# EAGLE design K_line_ESP32 (EAGLE 9.5.1)

## Sheet 1 of 2
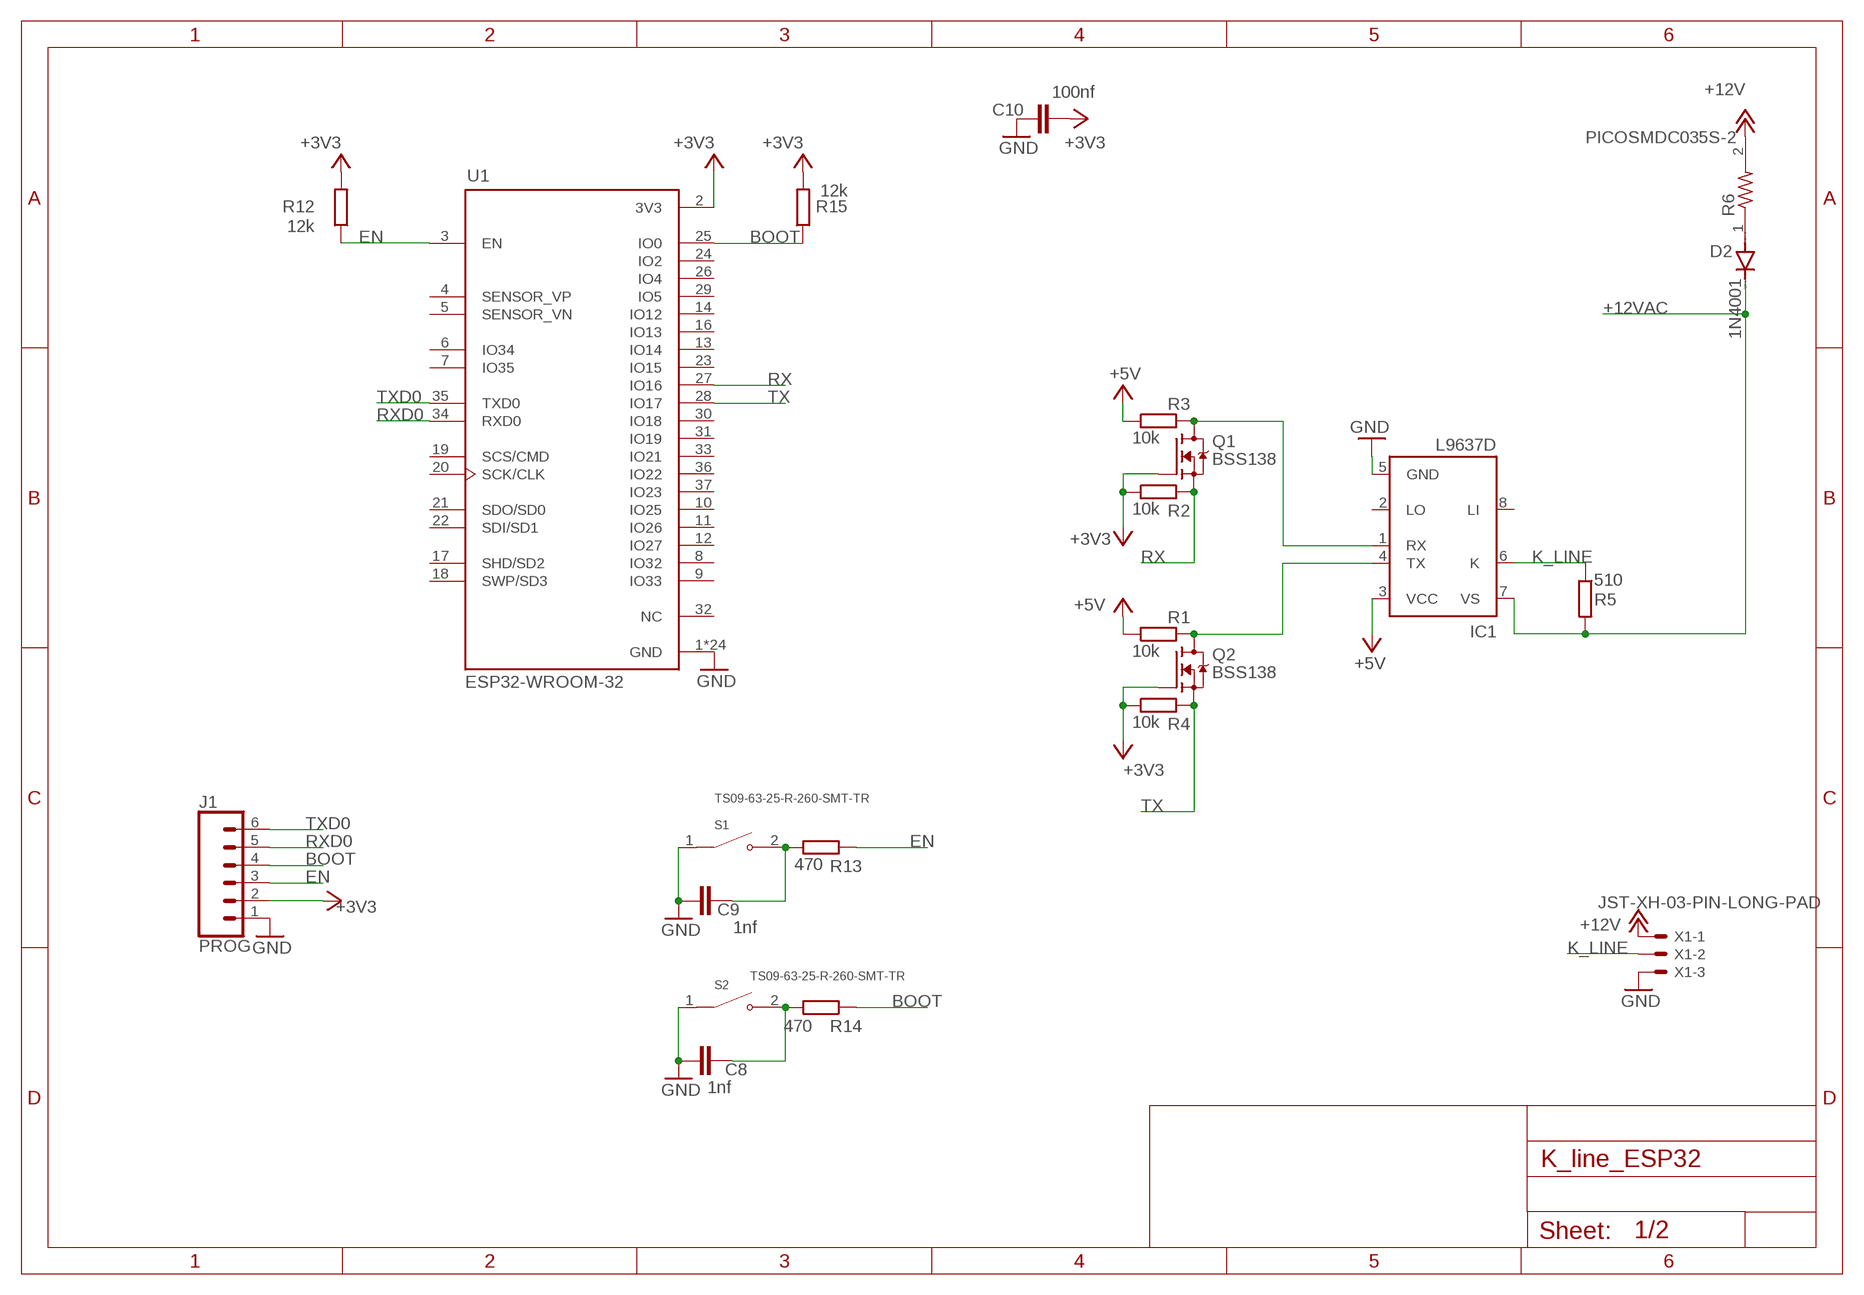
[diagram p0: schematic, sheet 1]

### Parts
C8  1nf  C-EUC0805K  [C0805K]
C9  1nf  C-EUC0805K  [C0805K]
C10  100nf  C-EUC0805K  [C0805K]
D2  1N4001  DIODE-DO214AA  [DO214AA]
IC1  L9637D  [SO08]
J1  PROG  CONN_06SILK_FEMALE_PTH  [1X06]
Q1  BSS138  [SOT95P240X111-3N]
Q2  BSS138  [SOT95P240X111-3N]
R1  10k  R-EU_R0805  [R0805]
R2  10k  R-EU_R0805  [R0805]
R3  10k  R-EU_R0805  [R0805]
R4  10k  R-EU_R0805  [R0805]
R5  510  R-EU_R0805  [R0805]
R6  PICOSMDC035S-2  [RESC2012X65N]
R12  12k  R-EU_R0805  [R0805]
R13  470  R-EU_R0805  [R0805]
R14  470  R-EU_R0805  [R0805]
R15  12k  R-EU_R0805  [R0805]
S1  TS09-63-25-R-260-SMT-TR  [SW_TS09-63-25-R-260-SMT-TR]
S2  TS09-63-25-R-260-SMT-TR  [SW_TS09-63-25-R-260-SMT-TR]
U1  ESP32-WROOM-32  [MODULE_ESP32-WROOM-32]
X1  JST-XH-03-PIN-LONG-PAD  [JST-XH-03-PACKAGE-LONG-PAD]

### Nets
+3V3: C10.2 J1.2 Q1.1(G) Q2.1(G) R2.1 R4.1 R12.2 R15.2 U1.2(3V3) ; also sheet 2
+5V: IC1.3(VCC) R1.1 R3.1 ; also sheet 2
+12V: R6.2 X1.1
+12VAC: D2.C IC1.7(VS) R5.2 ; also sheet 2
BOOT: J1.4 R14.1 R15.1 U1.25(IO0)
EN: J1.3 R12.1 R13.1 U1.3(EN)
GND: C8.2 C9.1 C10.1 IC1.5(GND) J1.1 S1.1 S2.1 U1.1(GND) U1.15(GND) U1.38(GND) U1.39_1(GND) U1.39_2(GND) U1.39_3(GND) U1.39_4(GND) U1.39_5(GND) U1.39_6(GND) U1.39_7(GND) U1.39_8(GND) U1.39_9(GND) U1.39_10(GND) U1.39_11(GND) U1.39_12(GND) U1.39_13(GND) U1.39_14(GND) U1.39_15(GND) U1.39_16(GND) U1.39_17(GND) U1.39_18(GND) U1.39_19(GND) U1.39_20(GND) U1.39_21(GND) X1.3 ; also sheet 2
K_LINE: IC1.6(K) R5.1 X1.2
N$1: IC1.1(RX) Q1.3(D) R3.2
N$2: IC1.4(TX) Q2.3(D) R1.2
N$3: D2.A R6.1
N$5: C8.1 R14.2 S2.2
N$10: C9.2 R13.2 S1.2
RX: Q1.2(S) R2.2 U1.27(IO16)
RXD0: J1.5 U1.34(RXD0)
TX: Q2.2(S) R4.2 U1.28(IO17)
TXD0: J1.6 U1.35(TXD0)
Unconnected: IC1.2(LO) IC1.8(LI) U1.4(SENSOR_VP) U1.5(SENSOR_VN) U1.6(IO34) U1.7(IO35) U1.8(IO32) U1.9(IO33) U1.10(IO25) U1.11(IO26) U1.12(IO27) U1.13(IO14) U1.14(IO12) U1.16(IO13) U1.17(SHD/SD2) U1.18(SWP/SD3) U1.19(SCS/CMD) U1.20(SCK/CLK) U1.21(SDO/SD0) U1.22(SDI/SD1) U1.23(IO15) U1.24(IO2) U1.26(IO4) U1.29(IO5) U1.30(IO18) U1.31(IO19) U1.32(NC) U1.33(IO21) U1.36(IO22) U1.37(IO23)

## Sheet 2 of 2
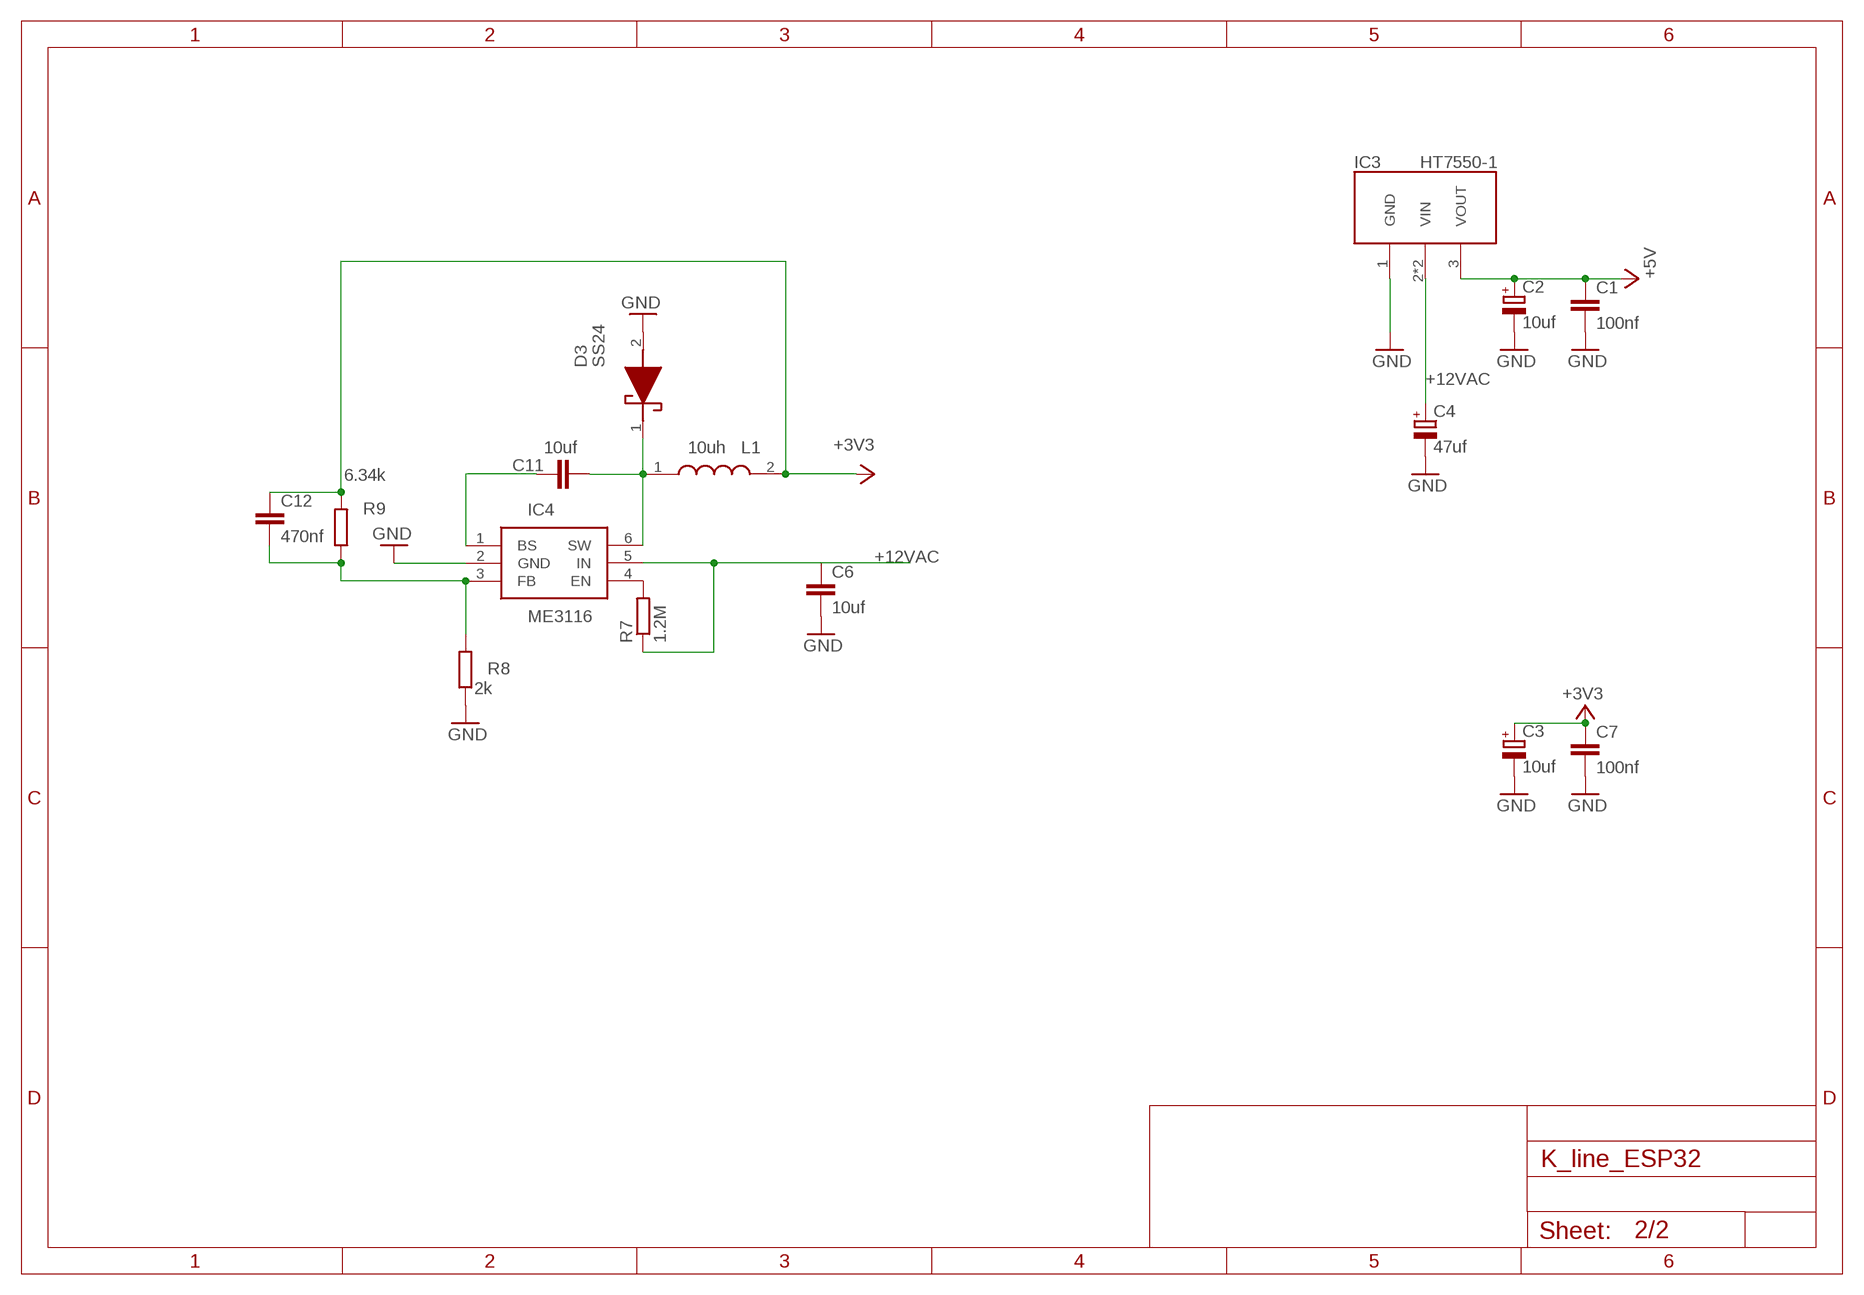
[diagram p1: schematic, sheet 2]

### Parts
C1  100nf  C-EUC0805K  [C0805K]
C2  10uf  CPOL-EUCT3216  [CT3216]
C3  10uf  CPOL-EUCT3216  [CT3216]
C4  47uf  C-POL_TANTALUM-1411(3528-METRIC)  [CAPMP3528X210N]
C6  10uf  C-EUC0805K  [C0805K]
C7  100nf  C-EUC0805K  [C0805K]
C11  10uf  C-EUC0805K  [C0805K]
C12  470nf  C-EUC0805K  [C0805K]
D3  SS24  [DIOM5436X247N]
IC3  HT7550-1  [SOT89]
IC4  ME3116  [SOT95P270X145-6N]
L1  10uh  MHCI06030-220M-R8  [INDPM7366X300N]
R7  1.2M  R-EU_R0805  [R0805]
R8  2k  R-EU_R0805  [R0805]
R9  6.34k  R-EU_R0805  [R0805]

### Nets
+3V3: C3.+ C7.1 C12.1 L1.2 R9.2 ; also sheet 1
+5V: C1.1 C2.+ IC3.3(VOUT) ; also sheet 1
+12VAC: C4.1(+) C6.1 IC3.2(VIN) IC3.2@1(VIN) IC4.5(IN) R7.1 ; also sheet 1
GND: C1.2 C2.- C3.- C4.2(-) C6.2 C7.2 D3.2(A) IC3.1(GND) IC4.2(GND) R8.1 ; also sheet 1
N$4: IC4.4(EN) R7.2
N$7: C11.2 D3.1(K) IC4.6(SW) L1.1
N$8: C11.1 IC4.1(BS)
N$9: C12.2 IC4.3(FB) R8.2 R9.1

## Library data of the parts
C1 C6-C12 = rcl:C-EU: CAPACITOR, European symbol; SPICEPREFIX: C
C2 C3 = rcl:CPOL-EU: POLARIZED CAPACITOR, European symbol; SPICEPREFIX: C
C4 = Capacitor:C-POL: Capacitor Polarised - Generic; CATEGORY: Capacitor
D2 = diode:DIODE-: DIODE
D3 = SS24:SS24: TAIWAN SEMICONDUCTOR - SS24 - SCHOTTKY RECTIFIER, 2A, 40V, DO-214AA Source: Datasheet <https://www.onsemi.com/pub/Collateral/SS24-D.PDF>; ARROW_PART_NUMBER: SS24; ARROW_PRICE-STOCK: https://www.arrow.com/en/products/ss24/taiwan-semiconductor?region=europe; DESCRIPTION: TAIWAN SEMICONDUCTOR - SS24 - SCHOTTKY RECTIFIER, 2A, 40V, DO-214AA; HEIGHT: 2.47mm; MANUFACTURER_NAME: Taiwan Semiconductor; MANUFACTURER_PART_NUMBER: SS24; MOUSER_PART_NUMBER: 821-SS24; MOUSER_PRICE-STOCK: https://www.mouser.co.uk/ProductDetail/Taiwan-Semiconductor/SS24?qs=JV7lzlMm3yKXRBg9WjRCYA%3D%3D
IC1 = L9637D:L9637D: ISO 9141 INTERFACE Source: 1765.pdf Check availability <https://pricing.snapeda.com/parts/L9637D/STMicroelectronics/view-part?ref=eda>; AVAILABILITY: In Stock; CHECK_PRICES: https://www.snapeda.com/parts/L9637D/STMicroelectronics/view-part/?ref=eda; DESCRIPTION: 1/1 Transceiver - ISO 9141 8-SOIC; MF: STMicroelectronics; MP: L9637D; PACKAGE: SO-8 STMicroelectronics; PRICE: None; SNAPEDA_LINK: https://www.snapeda.com/parts/L9637D/STMicroelectronics/view-part/?ref=snap
IC3 = HT7550-1:HT7550-1: 30Vin max 5Vout fixed LDO Check availability <https://pricing.snapeda.com/parts/HT7550-1/Holtek/view-part?ref=eda>; AVAILABILITY: Not in stock; CHECK_PRICES: https://www.snapeda.com/parts/HT7550-1/Holtek/view-part/?ref=eda; DESCRIPTION: Voltage stabiliser; LDO, fixed; 5V; 0.1A; SOT89; SMD; MF: Holtek; MP: HT7550-1; PACKAGE: None; PRICE: None; SNAPEDA_LINK: https://www.snapeda.com/parts/HT7550-1/Holtek/view-part/?ref=snap
IC4 = ME3116:ME3116: 40V 1A DC/DC ME3116 Source: Datasheet <https://datasheet.lcsc.com/szlcsc/Nanjing-Micro-One-Elec-ME3116_C97643.pdf>; DESCRIPTION: 40V 1A DC/DC ME3116; HEIGHT: 1.45mm; MANUFACTURER_NAME: Microne; MANUFACTURER_PART_NUMBER: ME3116
J1 = SparkFun-Connectors:CONN_06: Multi connection point. Often used as Generic Header-pin footprint for 0.1 inch spaced/style header connections On any of the 0.1 inch spaced packages, you can populate with these: Break Away Headers - Straight <https://www.sparkfun.com/products/116> (PRT-00116) Break Away Male Headers - Right Angle <https://www.sparkfun.com/products/553> (PRT-00553) Female Headers <https://www.sparkfun.com/products/115> (PRT-00115) Break Away Headers - Machine Pin <https://www.sparkfun.com/products/117> (PRT-00117) Break Away Female Headers - Swiss Machine Pin <https://www.sparkfun.com/products/743> (PRT-00743) Arduino Stackable Header - 6 Pin <https://www.sparkfun.com/products/9280> (PRT-09280) For SCREWTERMINALS and SPRING TERMINALS visit here: Screw Terimnals on SparkFun.com <https://www.sparkfun.com/search/results?term=Screw+Terminals> (5mm/3.5mm/2.54mm spacing) This device is also useful as a general connection point to wire up your design to another part of your project. Our various solder wires solder well into these plated through hole pads. Hook-Up Wire - Assortment (Stranded, 22 AWG) <https://www.sparkfun.com/products/11375> (PRT-11375) Hook-Up Wire - Assortment (Solid Core, 22 AWG) <https://www.sparkfun.com/products/11367> (PRT-11367) View the entire wire category on our website here <https://www.sparkfun.com/categories/141>; PROD_ID: CONN-08437
L1 = MHCI06030-220M-R8:MHCI06030-220M-R8: Power Inductors 22uH +/-20% 3A SMD,6.6x7.3x3.0mm RoHS Source: Datasheet <https://datasheet.lcsc.com/szlcsc/1811191357_Chilisin-Elec-MHCI06030-220M-R8_C329384.pdf>; DESCRIPTION: Power Inductors 22uH +/-20% 3A SMD,6.6x7.3x3.0mm RoHS; HEIGHT: 3mm; MANUFACTURER_NAME: Chilisin; MANUFACTURER_PART_NUMBER: MHCI06030-220M-R8
Q1 Q2 = BSS138:BSS138: N-Channel 50V 220mA (Ta) 360mW (Ta) Surface Mount SOT-23-3 Check availability <https://pricing.snapeda.com/parts/BSS138/ON%20Semiconductor/view-part?ref=eda> Check availability <https://pricing.snapeda.com/parts/BSS138/Diodes%20Inc./view-part?ref=eda>; AVAILABILITY: In Stock; CHECK_PRICES: https://www.snapeda.com/parts/BSS138/Diodes+Inc./view-part/?ref=eda; DESCRIPTION: N-CH MOSFET 50V 0.34A SOT-23-3L; MF: Diodes Inc.; MP: BSS138; PACKAGE: SOT-23-3 Diodes Inc.; PRICE: None; SNAPEDA_LINK: https://www.snapeda.com/parts/BSS138/Diodes+Inc./view-part/?ref=snap
R1-R5 R12-R15 = rcl:R-EU_: RESISTOR, European symbol; SPICEPREFIX: R
R6 = PICOSMDC035S-2:PICOSMDC035S-2: PTC Resettable Fuse 0.35A(hold) 0.75A(trip) 6VDC 100A 0.5W 0.2s 0.35Ohm SMD Solder Pad 0805 T/R Automotive Check availability <https://pricing.snapeda.com/parts/PICOSMDC035S-2/Littelfuse%20Inc./view-part?ref=eda>; AVAILABILITY: In Stock; DESCRIPTION: Polymeric PTC Resettable Fuse 6V 350 mA Ih Surface Mount 0805 (2012 Metric), Concave; MF: Littelfuse Inc.; MP: PICOSMDC035S-2; PACKAGE: 0805 TE Connectivity; PRICE: None; PURCHASE-URL: https://pricing.snapeda.com/search/part/PICOSMDC035S-2/?ref=eda
R7-R9 = resistor:R-EU_: RESISTOR, European symbol
S1 S2 = TS09-63-25-R-260-SMT-TR:TS09-63-25-R-260-SMT-TR: Check availability <https://pricing.snapeda.com/parts/TS09-63-25-R-260-SMT-TR/CUI%20Devices/view-part?ref=eda>; AVAILABILITY: In Stock; CHECK_PRICES: https://www.snapeda.com/parts/TS09-63-25-R-260-SMT-TR/CUI+Devices/view-part/?ref=eda; CUI_PURCHASE_URL: https://www.cuidevices.com/product/switches/tactile-switches/ts09-63-25-r-260-smt-tr?utm_source=snapeda.com&utm_medium=referral&utm_campaign=snapedaBOM; DESCRIPTION: 6.1 x 3.7 mm, 2.5 mm Actuator Height, 260 gf, Red, Surface Mount, SPST, Tactile Switch; MF: CUI Devices; MP: TS09-63-25-R-260-SMT-TR; PACKAGE: None; PRICE: None; PURCHASE-URL: https://www.snapeda.com/api/url_track_click_mouser/?unipart_id=11819256&manufacturer=CUI Devices&part_name=TS09-63-25-R-260-SMT-TR&search_term=switch tactile smd; SNAPEDA_LINK: https://www.snapeda.com/parts/TS09-63-25-R-260-SMT-TR/CUI+Devices/view-part/?ref=snap
U1 = ESP32-WROOM-32:ESP32-WROOM-32: Check availability <https://pricing.snapeda.com/parts/ESP32-WROOM-32/Espressif%20Systems/view-part?ref=eda>; AVAILABILITY: Not in stock; CHECK_PRICES: https://www.snapeda.com/parts/ESP32-WROOM-32/Espressif+Systems/view-part/?ref=eda; DESCRIPTION: Bluetooth, WiFi 802.11b/g/n, Bluetooth v4.2 +EDR, Class 1, 2 and 3 Transceiver Module 2.4GHz ~ 2.5GHz Antenna Not Included, U.FL Surface Mount; MF: Espressif Systems; MP: ESP32-WROOM-32; PACKAGE: None; PRICE: None; SNAPEDA_LINK: https://www.snapeda.com/parts/ESP32-WROOM-32/Espressif+Systems/view-part/?ref=snap
X1 = Rembrandt Electronics - JST XH Connectors v1-0:JST-XH-03-PIN: JST XH Connector 2 Pin Wire to board connector. Pitch: 2,54 mm, (0.100") Number of pins: 3 Created by Rembrandt Electronics www.rembrandtelectronics.com

## Board
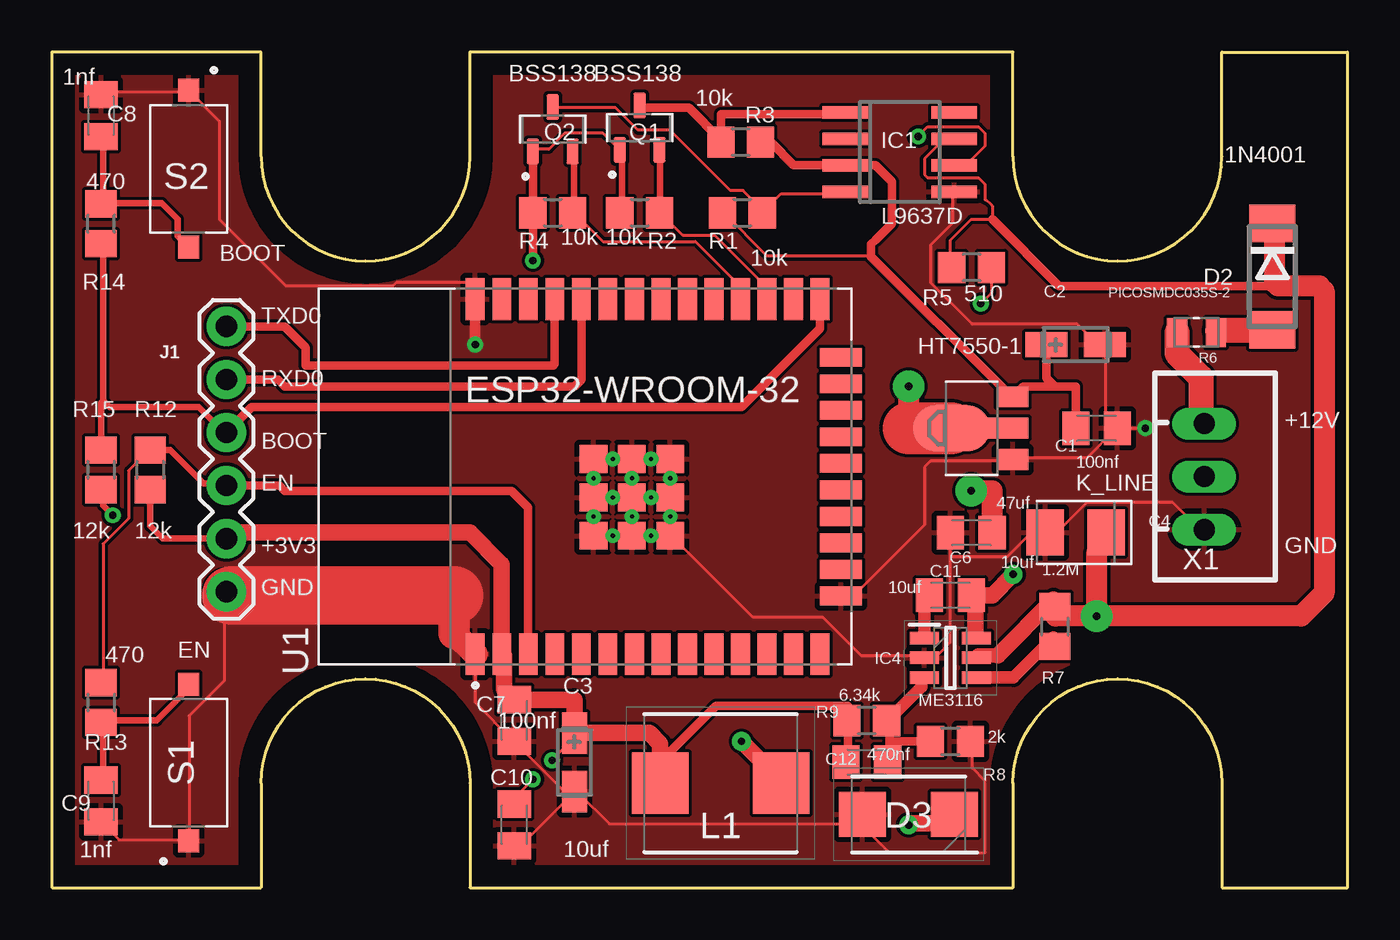
[diagram p2: board, top side]
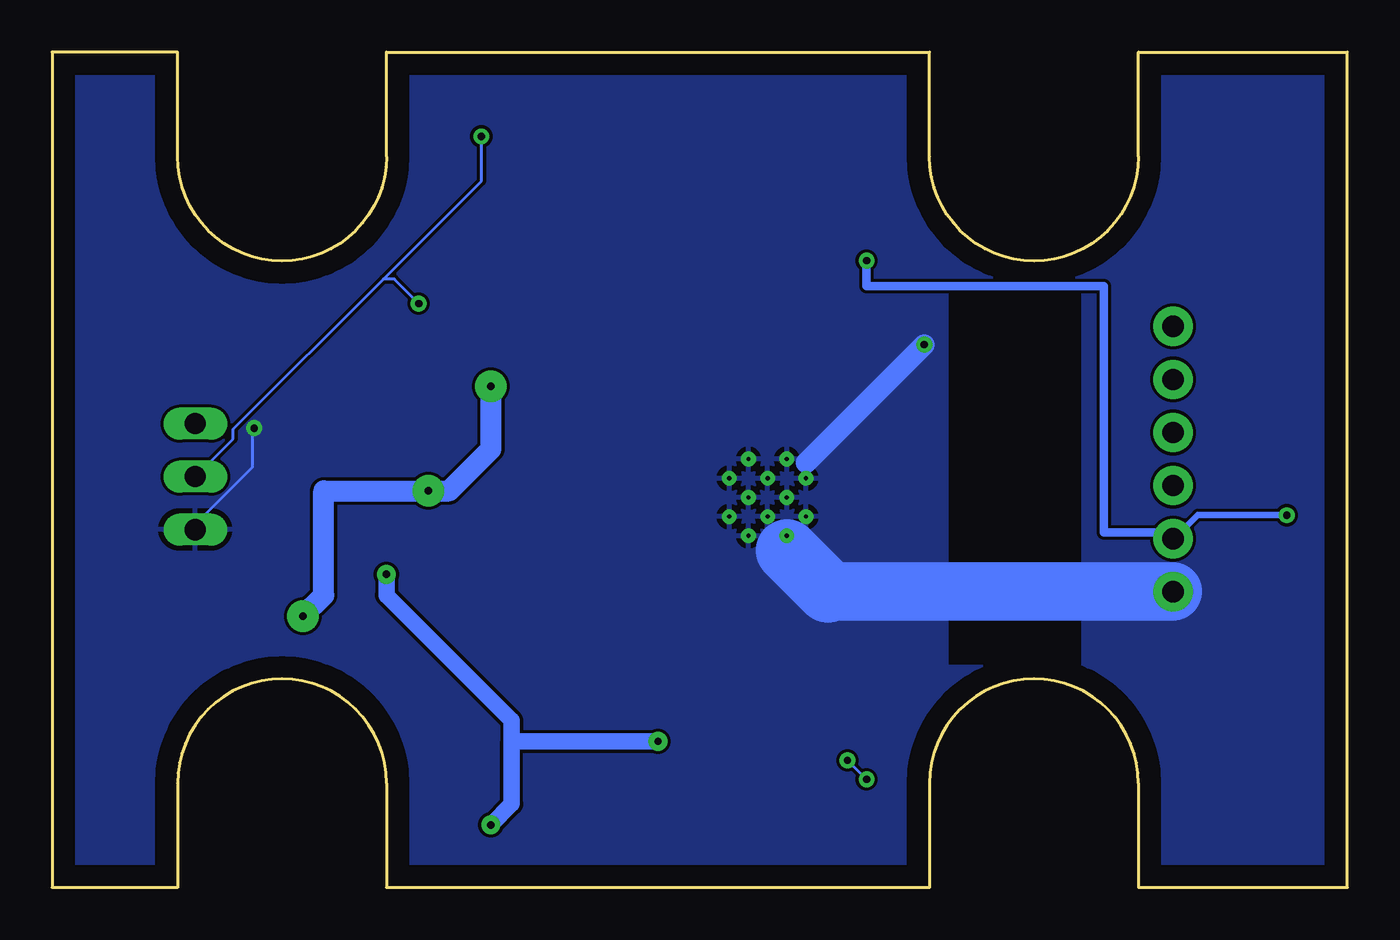
[diagram p3: board, bottom side, seen from below]

Size 62 x 40 mm. Coordinates in mm from the lower left corner, seen from the top.
Outline: 0,0 0,40 10,40 10,35 arc180 20,35 20,40 46,40 46,35 arc180 56,35 56,40 62,40 62,0 56,0 56,5 arc180 46,5 46,0 20,0 20,5 arc180 10,5 10,0 0,0
Copper layers (1*16): Top 0.035mm / dielectric 1.5mm / Bottom 0.035mm
Design rules "default": minimum track width 6mil, minimum drill 0.35mm, track to track 6mil, track to pad 6mil, pad to pad 6mil, via to via 6mil, smd to smd 6mil, copper to edge 40mil, drill to drill 6mil, minimum pad ring 10mil, minimum via ring 8mil, stop-mask expansion 4mil, vias tented up to drill 0mil, thermal gap 10mil

### Footprints (pad centres in the part's own frame; a part is rotated, then mirrored left to right if it is on the bottom)
C0805K = smd 1.3 x 1.6: 1 -1,0; 2 1,0
CT3216 = smd 2 x 1.2: + -1.4,0; - 1.4,0
CAPMP3528X210N = smd 1.796 x 2.204: 1 -1.46,0; 2 1.46,0
DO214AA = smd 1.8 x 2.2: A 2.55,0; C -2.55,0
DIOM5436X247N = smd 2.25 x 2.15: 1 -2.2,0; 2 2.2,0
SO08 = smd 0.6 x 2.2: 1 -1.905,-2.6; 2 -0.635,-2.6; 3 0.635,-2.6; 4 1.905,-2.6; 5 1.905,2.6; 6 0.635,2.6; 7 -0.635,2.6; 8 -1.905,2.6
SOT89 = smd 1 x 1.5: 1 -1.499,-1.981; 3 1.499,-1.981 | smd 1 x 2: 2 0,-1.727 | smd 2.2 x 3.7: 2@1 0,0.94
SOT95P270X145-6N = smd 1.4 x 0.6: 1 -1.25,0.95; 2 -1.25,0; 3 -1.25,-0.95; 4 1.25,-0.95; 5 1.25,0; 6 1.25,0.95
1X06 = drill 1.016 pad 1.88: 1 0,0; 2 2.54,0; 3 5.08,0; 4 7.62,0; 5 10.16,0; 6 12.7,0
INDPM7366X300N = smd 2.7 x 2.95: 1 -2.9,0; 2 2.9,0
SOT95P240X111-3N = smd 1.23 x 0.6: 1 -1.06,0.95; 2 -1.06,-0.95; 3 1.06,0
R0805 = smd 1.3 x 1.5: 1 -0.95,0; 2 0.95,0
RESC2012X65N = smd 0.97 x 1.38: 1 -0.93,0; 2 0.93,0
SW_TS09-63-25-R-260-SMT-TR = smd 1.1 x 1: 1 -3.75,0; 2 3.75,0
MODULE_ESP32-WROOM-32 = smd 2 x 0.9: 1 -8.5,5.26; 2 -8.5,3.99; 3 -8.5,2.72; 4 -8.5,1.45; 5 -8.5,0.18; 6 -8.5,-1.09; 7 -8.5,-2.36; 8 -8.5,-3.63; 9 -8.5,-4.9; 10 -8.5,-6.17; 11 -8.5,-7.44; 12 -8.5,-8.71; 13 -8.5,-9.98; 14 -8.5,-11.25; 25 8.5,-11.25; 26 8.5,-9.98; 27 8.5,-8.71; 28 8.5,-7.44; 29 8.5,-6.17; 30 8.5,-4.9; 31 8.5,-3.63; 32 8.5,-2.36; 33 8.5,-1.09; 34 8.5,0.18; 35 8.5,1.45; 36 8.5,2.72; 37 8.5,3.99; 38 8.5,5.26 | smd 0.9 x 2: 15 -5.715,-12.25; 16 -4.445,-12.25; 17 -3.175,-12.25; 18 -1.905,-12.25; 19 -0.635,-12.25; 20 0.635,-12.25; 21 1.905,-12.25; 22 3.175,-12.25; 23 4.445,-12.25; 24 5.715,-12.25 | smd 1.33 x 1.33: 39_1 -2.835,-0.405; 39_2 -1,-0.405; 39_3 0.835,-0.405; 39_4 -2.835,-2.24; 39_5 -1,-2.24; 39_6 0.835,-2.24; 39_7 -2.835,-4.075; 39_8 -1,-4.075; 39_9 0.835,-4.075 | drill 0.2 pad 0.3: 39_10 -1.917,-0.405; 39_11 -0.083,-0.405; 39_12 -2.835,-1.323; 39_13 -1,-1.323; 39_14 0.835,-1.323; 39_15 -1.917,-2.24; 39_16 -0.083,-2.24; 39_17 -2.835,-3.158; 39_18 -1,-3.158; 39_19 0.835,-3.158; 39_20 -1.917,-4.075; 39_21 -0.083,-4.075
JST-XH-03-PACKAGE-LONG-PAD = drill 1.016 long: 1 -2.54,0; 2 0,0; 3 2.54,0

### Placement (x,y rotation side)
C1  50,22 0 top
C2  49,26 0 top
C3  25,6 270 top
C4  49,17 180 top
C6  44,17 180 top
C7  22.12,8 270 top
C8  2.34,36.96 90 top
C9  2.34,4.15 90 top
C10  22.12,3 90 top
C11  43,14 0 top
C12  39,6 0 top
D2  58.42,29.26 270 top
D3  41,3.5 180 top
IC1  40.58,35.22 270 top
IC3  44,22 90 top
IC4  43,11 0 top
J1  8.34,14.17 90 top
L1  32,5 180 top
Q1  28.12,36.39 90 top
Q2  23.96,36.31 90 top
R1  33.04,32.31 0 top
R2  28.12,32.31 0 top
R3  32.96,35.69 180 top
R4  23.96,32.31 0 top
R5  44.01,29.69 180 top
R6  54.78,26.58 180 top
R7  48,12.5 270 top
R8  43,7 180 top
R9  39,8 180 top
R12  4.69,20 270 top
R13  2.34,8.86 270 top
R14  2.34,31.79 90 top
R15  2.34,20 270 top
S1  6.53,5.98 90 top
S2  6.53,34.42 270 top
U1  25.51,19.68 90 top
X1  55.15,19.68 270 top

### Tracks (layer width: path | path; a pad name or v marks a point on that pad's centre or on a via)
+3V3  (via drill 0.35)
  Top 0.152: 38.1,7.92 R9.2 | 29.11,5.03 L1.2 28.96,5.03 | 2.44,19.05 R15.2 | 8.23,16.76 J1.2 | 23.01,35.2 Q2.1 23.01,35.36 23.77,35.36 24.54,36.12 26.36,36.12 27.13,35.36 Q1.1 27.28,35.2 | 23.01,32.46 R4.1 | 27.28,32.46 R2.1 | 22.1,9.14 C7.1 | 21.64,11.12 U1.2 | v23.01,5.18 22.25,4.42 22.25,4.12 C10.2 | 24.54,6.71 25.15,7.32 C3.+ 24.54,6.71 | 24.54,6.71 v23.93,6.1 | 22.25,8.99 C7.1 | C7.1 21.64,9.48 | 38.1,6.1 38.1,6.71 C12.1 38.1,6.1
  Top 0.3: 2.44,19.05 2.44,18.29 v2.9,17.83 | 27.28,32.46 27.28,35.2 | J1.2 5.29,16.71 4.69,17.31 R12.2
  Top 0.4: 38.1,6.71 38.1,7.92 38.1,8.71 31.79,8.71 29.11,6.03 | 23.01,32.46 23.01,35.2 | v23.01,30.02 R4.1
  Top 0.8: 21.64,9.48 21.64,11.12 | U1.2 21.52,15.48 20,17 8.63,17 J1.2 | C7.1 25,9 C3.+ 28.6,7.4 29.11,6.89 29.11,6.03 29.11,5.03
  Bottom 0.152: J1.2 8.23,16.76 7.92,17.07 J1.2 | v23.93,6.1 v23.01,5.18 | J1.2 8.63,17
  Bottom 0.3: v2.9,17.83 7.16,17.83 7.92,17.07
  Bottom 0.4: v23.01,30.02 23.01,28.8 11.65,28.8 11.65,17 8.63,17
+5V
  Top 0.152: 47.55,25.91 C2.+ | 48.55,22.1 48.92,22.1 C1.1 | 39.17,30.24 34.22,30.24 32.16,32.31 R1.1 | 40.28,32.88 40.2,32.8 | 38.1,34.44 IC1.3 37.95,34.59 | 34.42,35.66 33.98,35.66 R3.1 | 46.02,23.54 46.02,23.62 45.98,23.58 IC3.3 45.6,23.88 45.52,23.88
  Top 0.4: 34.42,35.66 35.49,34.59 37.95,34.59 | 45.52,23.88 39.2,30.2 | 39.2,30.2 39.17,30.24 | IC1.3 39.41,34.59 40.2,33.8 40.2,32.8 40.2,31.8 39.41,31 39.2,30.8 39.2,30.2 | C1.1 49,24 48,24 | 48,24 46.48,24 IC3.3 | 48,24 47.6,24.4 C2.+
  Top 0.5: 46.02,23.54 IC3.3
+12V
  Top 0.152: 55,22.37 X1.1
  Top 1.2: R6.2 53.85,25.58 55,24.43 55,22.37
+12VAC  (via drill 0.35 pad 1.5)
  Top 0.152: 42.67,35.81 43.13,35.81 IC1.7 42.67,35.81 | 43.13,22.1 44.35,22.1 | 43.13,22.1 IC3.2@1 | 44.65,33 44.65,33.68 44.35,33.98 41.91,33.98 41.76,34.14 41.76,34.9 42.67,35.81 | 44.65,33 44.65,32.92 | 44.35,11.12 IC4.5 | 47.94,13.8 R7.1 48.04,13 | 44.35,22.1 45.72,22.1 IC3.2 | 44.35,22.1 IC3.2@1 | 50.75,16.76 50.6,16.92 C4.1 50.75,16.76 | 45.11,17.07 C6.1 44.96,17.07 | 42.98,22.1 43.03,22.03 IC3.2@1 | 60.89,28.58 60.67,28.8 | 58.67,28.8 58.52,28.96 | 58.52,31.7 D2.C | 50.75,16.76 50.75,16.61 | 43.03,22 43.13,22.1 | 50,16.02 50.75,16.76 | R5.2 43,29.75 43,31 44,32 45,32 45,32.65 44.65,33
  Top 0.4: 58.67,28.8 48.2,28.8 45,32
  Top 0.7: 45.26,11.12 44.35,11.12
  Top 0.8: 47.94,13.8 45.26,11.12
  Top 1: 58.52,28.96 58.52,31.7 | v50,13 48.04,13 | 60.67,28.8 58.67,28.8 | C6.1 45,19 v44,19 | v41,24 41,22 | v50,13 50,16.02 | 60.89,28.58 60.89,14.11 59.79,13 v50,13
  Top 2.5: 41,22 43.03,22
  Bottom 1: v41,24 41,21 43,19 v44,19 49,19 49,14 v50,13
BOOT
  Top 0.152: 2.9,21.03 2.44,21.03 R15.1 | 8.23,21.79 J1.4 | 2.44,30.79 R14.1 | 2.34,23.22 2.44,23.32
  Top 0.3: 2.44,30.79 2.44,23.32 2.76,23 7.02,23 8.23,21.79 | R15.1 2.34,23.22
  Top 0.4: U1.25 36.76,26.76 33,23 9.55,23 J1.4
EN
  Top 0.152: R13.1 2.44,9.91 2.44,16.46 3.66,17.68 3.66,19.96 4.57,20.88 R12.1 | 8.23,19.36 J1.3
  Top 0.3: 8.23,19.36 7.25,19.36 5.65,20.95 R12.1
  Top 0.4: U1.3 22.79,18.21 22,19 11.14,19 10.89,19.25 J1.3
GND  (via drill 0.35)
  Top 0.152: 22.22,1.88 C10.1 22.25,2.13 22.55,2.13 24.84,4.42 | 27.74,20.42 U1.39_6 | 29.57,20.42 U1.39_9 29.57,20.57 28.8,20.57 U1.39_19 28.65,20.57 27.89,20.57 U1.39_6 | 27.74,18.59 U1.39_5 | 25.91,18.59 U1.39_2 | U1.39_1 25.91,16.76 25.3,16.76 U1.39_1 | 8.97,14.17 8.98,14.16 | 8.98,14.16 9.14,14 | C1.2 v52.33,22 | S2.1 6.4,38.1 2.44,38.1 C8.2 | C9.1 2.44,3.05 3.2,2.29 6.4,2.29 S1.1 6.55,2.29 6.55,8.23 8.23,9.91 8.23,14.02 J1.1 | 8.38,14.17 8.99,14.17 | 8.99,14.17 8.98,14.16 | 8.38,14.17 J1.1 | 6.55,38.1 S2.1 | 8.99,14.17 J1.1 | 42.98,15.85 42.98,16.92 C6.2 | 42.98,15.85 42.98,11.73 42.37,11.12 41.76,11.12 IC4.2 41.6,11.12 38.71,11.12 36.88,12.95 33.53,12.95 29.72,16.76 U1.39_7 29.57,16.92 | 42.98,15.85 45.72,15.85 46.79,16.92 47.4,16.92 C4.2 47.55,17.07 48.16,17.07 49.53,18.44 53.65,18.44 55.02,17.07 X1.3 | C1.2 50.9,21.95 49.53,20.57 46.02,20.57 IC3.1 45.87,20.42 42.04,20.42 41.76,20.14 41.76,17.37 38.41,14.02 37.8,14.02 U1.15 | C1.2 50.9,22.1 50.44,22.55 50.44,25.91 C2.- 50.29,26.06 49.99,26.06 49.07,26.98 44.04,26.98 42.06,28.96 42.06,30.79 43.13,31.85 43.13,33.22 IC1.5 | U1.39_2 25.91,18.75 25.91,19.51 U1.39_11 25.91,19.66 25.91,20.42 U1.39_3 | 27.74,18.75 26.98,18.75 U1.39_13 26.82,18.75 26.06,18.75 U1.39_2 | 27.74,18.75 27.74,19.51 U1.39_16 | 27.74,18.75 U1.39_5 | 29.57,18.75 28.8,18.75 U1.39_18 28.65,18.75 27.89,18.75 U1.39_5 | 29.57,18.75 29.57,19.51 U1.39_21 | 29.57,18.75 U1.39_8 29.57,18.59 29.57,17.83 U1.39_20 29.57,17.68 29.57,16.92 | 29.57,16.92 28.8,16.92 U1.39_17 28.65,16.92 27.89,16.92 U1.39_4 27.74,16.92 | U1.39_1 25.91,16.92 25.91,17.68 U1.39_10 | 27.74,16.92 26.98,16.92 U1.39_12 26.82,16.92 26.06,16.92 U1.39_1
  Top 0.152: 27.74,16.92 27.74,17.68 U1.39_15 | U1.39_3 26.06,20.57 26.82,20.57 U1.39_14 26.98,20.57 27.74,20.57 U1.39_6 | 25.91,20.57 U1.39_3 | R8.1 44.04,6.86 44.04,5.72 44.65,5.12 44.65,1.68 40.08,1.68 38.33,3.43 D3.2 38.73,3.05 26.67,3.05 25.15,4.57 C3.- | 24.84,4.42 24.99,4.57 C3.- | 24.84,4.42 24.69,4.42 22.25,6.86 C7.2 22.1,7.01 20.27,8.84 20.27,11.12 U1.1 20.27,11.28 20.27,11.73 | 24.84,4.42 C3.- | S2.1 8,36.7 8,32 11.17,28.83 16.33,28.83 16.5,29 20,29 20.25,28.75 U1.38 | 8.55,14 8.38,14.17
  Top 0.5: v20.25,26 U1.38
  Top 1.2: U1.1 19.25,12.18
  Top 1.5: 19.25,14 19.25,12.18
  Top 2.8: 19.25,14 8.55,14
  Bottom 0.152: X1.3 55.02,17.22 55.02,17.53 52.43,20.12 52.43,21.95 v52.33,22 | 25.91,20.34 U1.39_11 | U1.39_12 26.83,16.15
  Bottom 1: v20.25,26 25.91,20.34
  Bottom 2.8: 24.85,14.17 J1.1
  Bottom 3: 26.83,16.15 24.85,14.17
  pour Top: 0,0 0,40 62,40 62,0
  pour Bottom: 0,0 0,40 62,40 62,0
K_LINE  (via drill 0.35)
  Top 0.152: 45.11,29.57 R5.1 44.96,28.47 v44.45,27.97 | 55.02,19.81 X1.2 | v41.45,35.97 41.91,36.42 44.35,36.42 44.65,36.12 44.65,35.51 43.74,34.59 43.28,34.59 IC1.6
  Bottom 0.152: v41.45,35.97 41.45,33.83 46.14,29.14 | 46.14,29.14 53.34,21.95 53.34,21.49 55.02,19.81 X1.2 | v44.45,27.97 45.63,29.14 46.14,29.14
N$1
  Top 0.152: 28.19,37.34 Q1.3 | 32,35.81 R3.2 | 37.95,37.03 IC1.1
  Top 0.4: 28.19,37.34 30.48,37.34 32,35.81 | 37.95,37.03 32.01,37.03 R3.2
N$2
  Top 0.152: Q2.3 24.08,37.34 26.98,37.34 28.04,36.27 29.57,36.27 32.46,33.38 33.07,33.38 33.98,32.46 R1.2 34.14,32.46 34.9,33.22 37.95,33.22 IC1.4
N$3
  Top 0.152: 55.78,26.67 R6.1 | 58.37,26.67 D2.A
  Top 1.2: 58.37,26.67 55.78,26.67
N$4
  Top 0.152: 44.35,10.06 IC4.4 | 47.94,11.97 R7.2
  Top 0.6: 44.35,10.06 46.02,10.06 47.94,11.97
N$5
  Top 0.152: 6.4,30.79 S2.2 | 2.44,32.61 R14.2 2.44,32.77 | 2.44,35.81 C8.1
  Top 0.3: 2.44,35.81 2.44,32.77 5.23,32.77 6,32 6,31.2 S2.2
N$7  (via drill 0.35 pad 0.9)
  Top 0.152: 44.2,13.72 44.04,13.87 C11.2 | 44.2,12.04 IC4.6 44.2,11.89 43.74,11.89 | 35.05,4.88 L1.1 34.9,5.1 | 42.98,3.37 42.98,3.05 43.14,3.05 D3.1 43.2,3.08 43.13,3.05 | v41,3 41.08,3.08
  Top 0.8: 44.2,13.72 44.2,12.04 | v33,7 34.9,5.1 | v46,15 45,14 C11.2 | 41.08,3.08 43.2,3.08
  Bottom 0.8: v46,15 46,14 40,8 40,7 | 40,7 v33,7 | v41,3 40,4 40,7
N$8
  Top 0.152: 41.76,13.72 41.91,13.87 C11.1 | 41.76,12.04 IC4.1
  Top 0.6: 41.76,13.72 41.76,12.04
N$9
  Top 0.152: 40.54,8.38 40.39,8.38 40.08,8.08 R9.1 40.08,7.92 | 41.91,7.01 R8.2 | 40.08,6.1 C12.2
  Top 0.4: 41.6,9.91 IC4.3 | 40.39,8.38 R9.1 | 40.08,7.92 40.08,7 | 40.08,7 40.08,6.1 | R8.2 40.08,7
  Top 0.6: 41.6,9.91 41.6,9.6 40.39,8.38
N$10
  Top 0.152: S1.2 6.4,9.6 6.4,9.4 | 2.44,7.92 R13.2 | 2.44,5.18 C9.2 | 2.44,7.77 R13.2 | R13.2 2.43,8
  Top 0.3: 2.44,7.77 2.44,5.18 | 2.43,8 5,8 6.4,9.4
RX
  Top 0.152: 29.11,35.2 Q1.2 | 29.11,32.46 R2.2 29.11,32.31 30.18,31.24 31.7,31.24 34.14,28.8 34.14,28.19 U1.27
  Top 0.3: 29.11,32.46 29.11,35.2
RXD0
  Top 0.152: 25.3,28.8 25.3,28.19 U1.34
  Top 0.4: U1.34 25.33,24.33 25,24 11.14,24 10.81,24.33 J1.5
TX
  Top 0.152: 24.99,35.2 Q2.2 | 24.99,32.46 R4.2 24.99,32.31 26.36,30.94 30.79,30.94 32.92,28.8 32.92,28.19 U1.28
  Top 0.3: 24.99,32.46 24.99,35.2
TXD0
  Top 0.152: 24.06,25.06 24,25
  Top 0.4: U1.35 24.06,25.06 | 24,25 12.14,25 12.14,25.86 11.13,26.87 J1.6

### Text on the board
tNames: BOOT | TXD0 | RXD0 | +12V | BOOT | EN | K_LINE | +3V3 | GND | GND | EN